# EAGLE design PillowShield 1.0 (EAGLE 5.11)
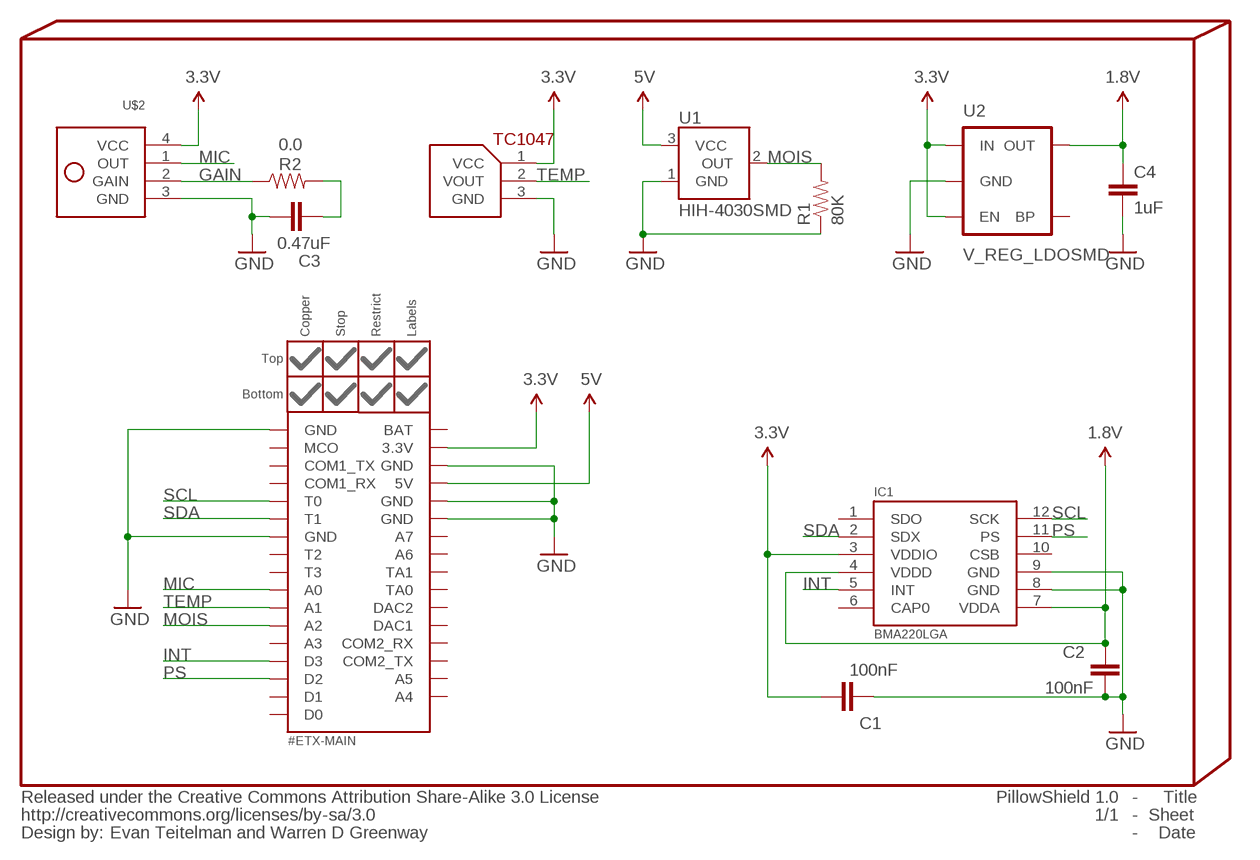
[diagram p0: schematic, sheet 1]

## Parts
C1  100nF  CAP0603-CAP  [0603-CAP]
C2  100nF  CAP0603-CAP  [0603-CAP]
C3  0.47uF  CAP0603-CAP  [0603-CAP]
C4  1uF  CAP0603-CAP  [0603-CAP]
FP1  #ETX-MAIN  #NEBULAPTH  [#NEBULA-PTH]
IC1  BMA220LGA  [LGA12]
INFO1  Evan Teitelman and Warren D Greenway  %CC-BY-SA  [%CC-BY-SA]
PART1  #NEBULA-PARTRESTRICT  [#NEBULA-RESTRICT]
PART2  #NEBULA-PARTRESTRICT  [#NEBULA-RESTRICT]
PART3  #NEBULA-PARTSTOP  [#NEBULA-STOP]
PART4  #NEBULA-PARTSTOP  [#NEBULA-STOP]
PART5  #NEBULA-PARTPADS  [#NEBULA-PADS]
PART6  #NEBULA-PARTPADS  [#NEBULA-PADS]
PART7  #NEBULA-PARTLABELS-TOP  [#NEBULA-LABELS-TOP]
R1  80K  RESISTOR0603-RES  [0603-RES]
R2  0.0  RESISTOR0603-RES  [0603-RES]
U1  HIH-4030SMD  [HIH-4030]
U2  V_REG_LDOSMD  [SOT23-5]
U$1  MICROCHIP-TEMP-TC1047  [SOT23]
U$2  MIC_KNOWLES_SPM0408HE5H  [SPM0408HE5H]

## Nets
1.8V: C2.1 C4.1 IC1.4(VDDD) IC1.7(VDDA) U2.5(OUT) ; supply symbol labelled @1.8V
3.3V: C1.1 FP1.3.3V IC1.3(VDDIO) U2.1(IN) U2.3(EN) U$1.1(VCC) U$2.4(VCC) ; supply symbol labelled @3.3V
5V: FP1.5V U1.3(VCC) ; supply symbol labelled @5V
GAIN: R2.1 U$2.2(GAIN)
GND: C1.2 C2.2 C3.1 C4.2 FP1.GND1(GND) FP1.GND2(GND) FP1.GND3(GND) FP1.GND4(GND) FP1.GND5(GND) IC1.8(GND) IC1.9(GND) R1.1 U1.1(GND) U2.2(GND) U$1.3(GND) U$2.3(GND) ; supply symbol labelled @GND
INT: FP1.D3 IC1.5(INT)
MIC: FP1.A0 U$2.1(OUT)
MOIS: FP1.A2 R1.2 U1.2(OUT)
N$1: C3.2 R2.2
PS: FP1.D2 IC1.11(PS)
SCL: FP1.T0 IC1.12(SCK)
SDA: FP1.T1 IC1.2(SDX)
TEMP: FP1.A1 U$1.2(VOUT)
Unconnected: FP1.A3 FP1.A4 FP1.A5 FP1.A6 FP1.A7 FP1.BAT FP1.COM1_RX FP1.COM1_TX FP1.COM2_RX FP1.COM2_TX FP1.D0 FP1.D1 FP1.DAC1 FP1.DAC2 FP1.MCO FP1.T2 FP1.T3 FP1.TA0 FP1.TA1 IC1.1(SDO) IC1.6(CAP0) IC1.10(CSB) U2.4(BP)

## Library data of the parts
C1-C4 = SparkFun:CAP: Capacitor Standard 0603 ceramic capacitor, and 0.1" leaded capacitor.
FP1 = PygmyBoards:#NEBULA: Nebula Board and Shield Footprint Pads This is the only absolutely required part for the footprint. The parts in "#NEBULA-PART" are merely aesthetic. A circular board outline should be .001" thick and 1.005" in diameter (Reference circle on the Document (48) layer provided).
IC1 = EagleLbr:BMA220: Triaxial (3 axis) Accelerometer +-2g to +-16g with on-chip motion-triggered interrupt controller Manufacturer: Bosch Links: Datasheet <http://www.bosch-sensortec.com/content/language1/downloads/BST-BMA220-DS003-07.pdf>
INFO1 = PygmyBoards:%CC-BY-SA: Creative Commons Attribution-ShareAlike License <http://creativecommons.org/licenses/by-sa/3.0/>
PART1-PART7 = PygmyBoards:#NEBULA-PART: Nebula Board and Shield Footprint Parts These parts are only functional when combined with the pads in "#NEBULA".
R1 R2 = SparkFun:RESISTOR: Resistor Basic schematic elements and footprints for 0603, 1206, and PTH resistors.
U1 = SparkFun:HIH-4030: Humidity Sensor
U2 = SparkFun:V_REG_LDO: Voltage Regulator LDO Standard 150mA LDO voltage regulator in SOT-23 layout. Micrel part MIC5205. BP (by-pass) pin is used to lower output noise with 470pF cap.
U$1 = dublib:MICROCHIP-TEMP-TC1047
U$2 = Pygmy:MIC_KNOWLES_SPM0408HE5H: Knowles Acoustics Amplified Microphone

## Board
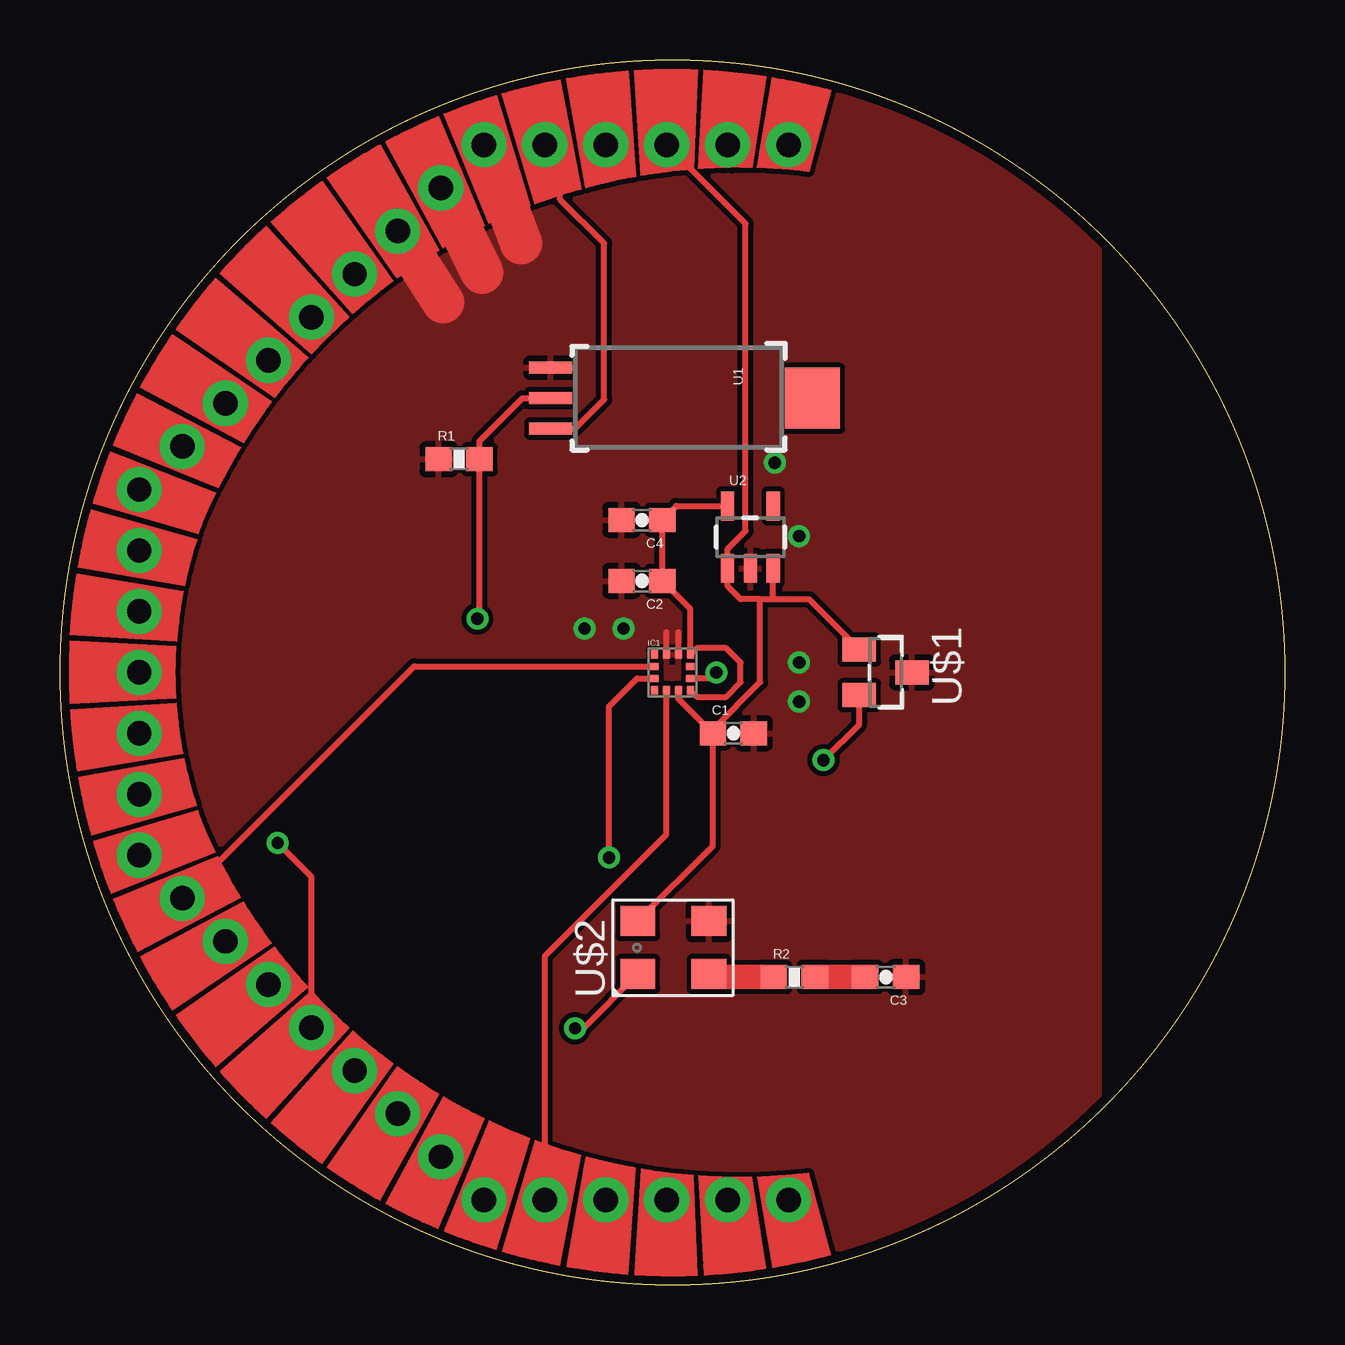
[diagram p1: board, top side]
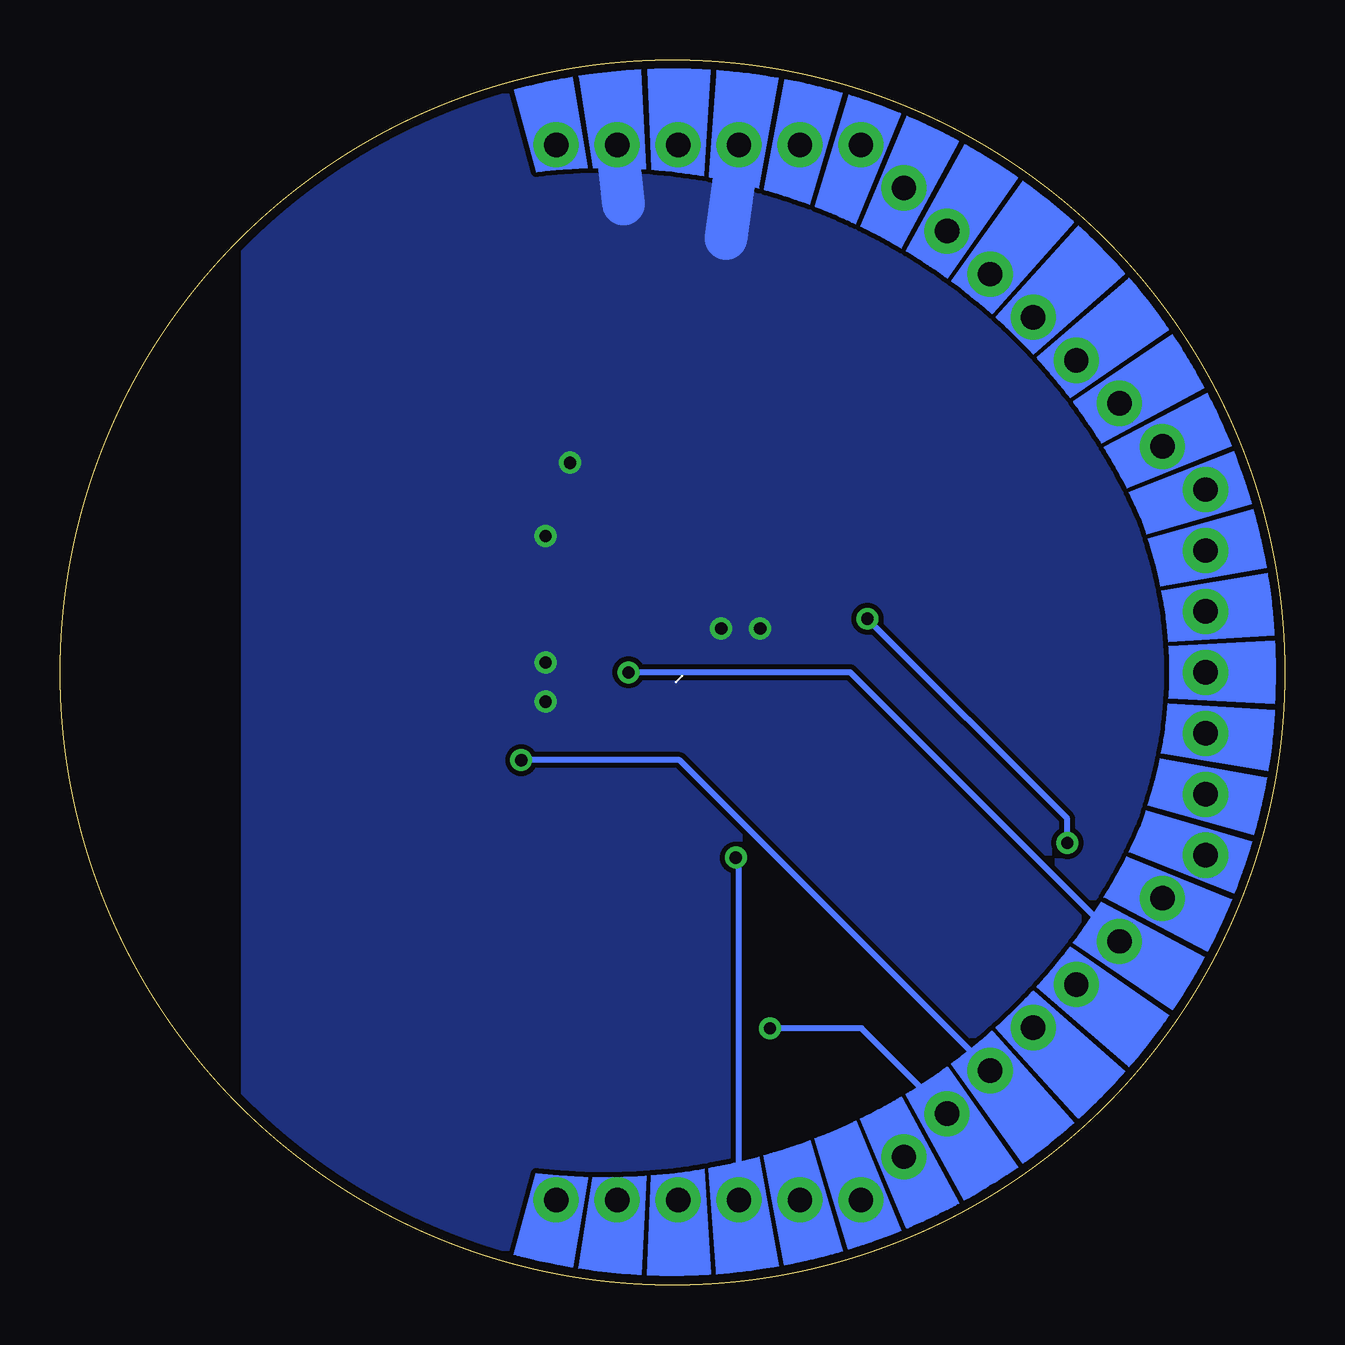
[diagram p2: board, bottom side, seen from below]

Size 51.05 x 51.05 mm. Coordinates in mm from the lower left corner, seen from the top.
Outline: circle at 25.53,25.53 radius 25.53
Copper layers (1*16): Top 0.035mm / dielectric 1.5mm / Bottom 0.035mm
Design rules "PDX (Proto)": minimum track width 6mil, minimum drill 15mil, track to track 6mil, track to pad 6mil, pad to pad 4mil, via to via 6mil, smd to smd 4mil, copper to edge 15mil, drill to drill 6mil, minimum pad ring 10mil, minimum via ring 8mil, stop-mask expansion 4mil, vias tented up to drill 0mil, thermal gap 10mil

### Footprints (pad centres in the part's own frame; a part is rotated, then mirrored left to right if it is on the bottom)
0603-CAP = smd 1.1 x 1: 1 -0.85,0; 2 0.85,0
#NEBULA-PTH = drill 1.016 pad 1.88 round: 3.3V -25.637,-47.388; 5V -30.716,-47.388; A0 -36.848,-7.004; A1 -38.645,-8.8; A2 -40.44,-10.596; A3 -42.237,-12.392; A4 -47.625,-22.86; A5 -47.625,-25.4; A6 -40.44,-40.204; A7 -38.645,-42; BAT -20.557,-47.388; COM1_RX -25.636,-3.412; COM1_TX -23.096,-3.412; COM2_RX -47.625,-30.48; COM2_TX -47.625,-27.94; D0 -47.625,-20.32; D1 -47.625,-17.78; D2 -45.829,-15.984; D3 -44.032,-14.188; DAC1 -47.625,-33.02; DAC2 -45.829,-34.816; GND1 -36.848,-43.796; GND2 -35.052,-45.592; GND3 -33.256,-47.388; GND4 -28.177,-47.388; GND5 -23.097,-47.388; MCO -20.556,-3.412; T0 -28.176,-3.412; T1 -30.716,-3.412; T2 -33.256,-3.412; T3 -35.052,-5.208; TA0 -44.032,-36.612; TA1 -42.237,-38.408
LGA12 = smd 0.3 x 0.35: 1 -0.75,-0.75; 2 -0.25,-0.75; 3 0.25,-0.75; 4 0.75,-0.75; 7 0.75,0.75; 8 0.25,0.75; 9 -0.25,0.75; 10 -0.75,0.75 | smd 0.35 x 0.3: 5 0.75,-0.25; 6 0.75,0.25; 11 -0.75,0.25; 12 -0.75,-0.25
0603-RES = smd 1.1 x 1: 1 -0.85,0; 2 0.85,0
HIH-4030 = smd 0.508 x 1.778: 1 -1.27,-5.08; 2 0,-5.08; 3 1.27,-5.08 | smd 2.54 x 2.286: NC 0,5.842
SOT23-5 = smd 0.55 x 1.2: 1 -0.95,-1.3; 2 0,-1.3; 3 0.95,-1.3; 4 0.95,1.3; 5 -0.95,1.3
SOT23 = smd 1 x 1.4: 1 -0.95,-1.1; 2 0.95,-1.1; 3 0,1.1
SPM0408HE5H = smd 1.245 x 1.448: 1 -1.143,1.448; 2 -1.143,-1.524; 3 1.067,-1.524; 4 1.067,1.448

### Placement (x,y rotation side)
C1  28.07,22.99 0 top
C2  24.26,29.34 180 top
C3  34.42,12.83 180 top
C4  24.26,31.88 180 top
FP1  50.93,0.13 180 bottom
IC1  25.53,25.53 0 top
INFO1  -2.41,-10.03 0 top  (outside the outline)
PART1  50.93,50.93 0 top
PART2  50.93,0.13 180 bottom
PART3  50.93,0.13 180 bottom
PART4  50.93,50.93 0 top
PART5  50.93,0.13 180 bottom
PART6  50.93,50.93 0 top
PART7  50.93,0.13 180 bottom
R1  16.64,34.42 0 top
R2  30.61,12.83 0 top
U1  25.53,36.96 270 top
U2  28.78,31.17 0 top
U$1  34.42,25.53 270 top
U$2  25.53,14.1 90 top

### Tracks (layer width: path | path; a pad name or v marks a point on that pad's centre or on a via)
1.8V
  Top 0.254: IC1.4 26.54,24.51 27.76,24.51 28.37,25.12 28.37,25.93 27.76,26.54 26.54,26.54 IC1.7 26.28,28.17 C2.1 C4.1 25.7,32.47 U2.5
3.3V
  Top 0.254: IC1.3 25.78,24.43 C1.1 | 29.18,28.57 28.37,28.57 27.83,29.12 U2.1 27.83,30.67 28.57,31.42 28.57,44.23 FP1.3.3V | C1.1 27.22,18.3 U$2.4 | C1.1 27.22,23.15 29.18,25.12 29.18,28.57 | U$1.1 31.22,28.57 29.69,28.57 | 29.18,28.57 29.69,28.57 | U2.3 29.73,28.61 29.69,28.57
5V
  Top 0.254: U1.3 21.46,35.69 22.68,36.91 22.68,43.41 20.85,45.24 20.85,46.87 FP1.5V
GAIN
  Top 1.016: U$2.2 27.18,12.83 R2.1
GND  (via drill 0.51)
  Top 0.254: IC1.8 25.78,27.2 | 25.27,27.2 IC1.9
  Top 1.778: FP1.GND1 15.98,40.97 | 17.6,42.19 FP1.GND2 | FP1.GND3 19.23,43.41
  Bottom 1.778: 27.56,45.03 FP1.GND5 | FP1.GND4 23.29,43.61
  other vias: 23.5,27.36 21.87,27.36 30.81,25.93 30.81,24.31 30.81,31.22 29.79,34.26
  pour Top (isolate 0.203): -1.14,52.2 43.31,52.2 43.31,-1.14 -1.14,-1.14
  pour Bottom (isolate 0.203): -2.41,53.47 43.31,53.47 43.31,-2.41 -2.41,-2.41
INT  (via drill 0.51)
  Top 0.254: IC1.5 27.11,25.28 v27.36,25.53
  Bottom 0.254: v27.36,25.53 18.11,25.53 FP1.D3 | FP1.D3
MIC  (via drill 0.51)
  Top 0.254: U$2.1 21.82,10.69 v21.46,10.69
  Bottom 0.254: v21.46,10.69 17.64,10.69 FP1.A0
MOIS  (via drill 0.51)
  Top 0.254: U1.2 19.28,36.96 17.49,35.17 R1.2 17.49,27.85 v17.4,27.76 | v9.07,18.41 10.49,17 FP1.A2
  Bottom 0.254: v17.4,27.76 9.07,19.43 v9.07,18.41
N$1
  Top 1.016: R2.2 C3.2
PS
  Top 0.254: IC1.11 14.76,25.78 FP1.D2 | FP1.D2
SCL  (via drill 0.51)
  Top 0.254: v22.88,17.8 22.88,24.11 24.06,25.28 IC1.12
  Bottom 0.254: v22.88,17.8 22.75,17.67 FP1.T0
SDA
  Top 0.254: IC1.2 25.28,18.77 20.21,13.71 FP1.T1
TEMP  (via drill 0.51)
  Top 0.254: U$1.2 33.32,23.36 v31.83,21.87
  Bottom 0.254: v31.83,21.87 25.23,21.87 FP1.A1

### Text on the board
tTest: Warren D Greenway | Evan Teitelman | Designed By: | Pygmy Pillow Shield
Document: Note: This Board Is Mirrored